# EAGLE design full (EAGLE 7.0.0)
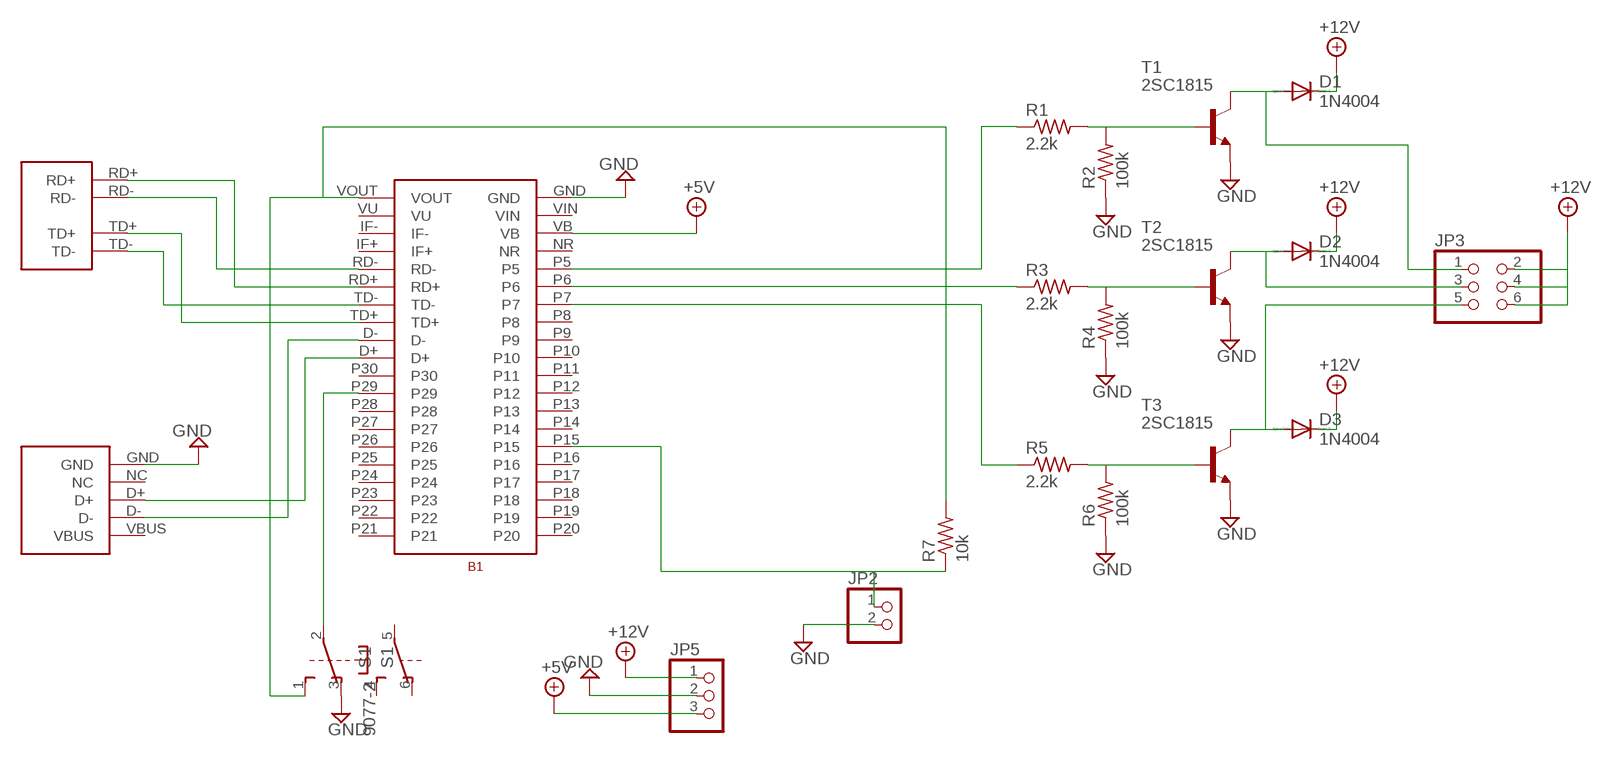
[diagram p0: schematic, sheet 1]

## Parts
B1  MBED_LPC1768  [MBED_LPC1768]
D1  1N4004  [DO41-10]
D2  1N4004  [DO41-10]
D3  1N4004  [DO41-10]
JP2  PINHD-1X2  [1X02]
JP3  PINHD-2X3  [2X03]
JP5  PINHD-1X3  [1X03]
R1  2.2k  R-US_0204/7  [0204/7]
R2  100k  R-US_0204/7  [0204/7]
R3  2.2k  R-US_0204/7  [0204/7]
R4  100k  R-US_0204/7  [0204/7]
R5  2.2k  R-US_0204/7  [0204/7]
R6  100k  R-US_0204/7  [0204/7]
R7  10k  R-US_0204/7  [0204/7]
RJ45_DIP1  AKIZUKI_RJ45_DIP  [AKIZUKI_RJ45_DIP]
S1  9077-2  [9077-2]
T1  2SC1815  [TO92-ECB]
T2  2SC1815  [TO92-ECB]
T3  2SC1815  [TO92-ECB]
USB_B1  AKIZUKI_MINI_USB_DIP  [AKIZUKI_MINI_USB_DIP]

## Nets
+5V: B1.VB JP5.3
+12V: D1.C D2.C D3.C JP3.2 JP3.4 JP3.6 JP5.1
GND: B1.GND JP2.2 JP5.2 R2.1 R4.1 R6.1 S1.3(1:O) T1.E T2.E T3.E USB_B1.GND
N$1: R1.2 R2.2 T1.B
N$2: R3.2 R4.2 T2.B
N$3: R5.2 R6.2 T3.B
N$4: B1.P6 R3.1
N$5: B1.P5 R1.1
N$6: B1.P7 R5.1
N$7: D1.A JP3.1 T1.C
N$8: D2.A JP3.3 T2.C
N$9: D3.A JP3.5 T3.C
N$10: B1.RD- RJ45_DIP1.RD-
N$11: B1.RD+ RJ45_DIP1.RD+
N$12: B1.TD+ RJ45_DIP1.TD+
N$13: B1.TD- RJ45_DIP1.TD-
N$14: B1.P29
N$15: B1.D+ USB_B1.D+
N$16: B1.D- USB_B1.D-
N$27: B1.P15 JP2.1 R7.1
N$29: B1.VOUT R7.2 S1.1(1:S)
Unconnected: B1.IF+ B1.IF- B1.NR B1.P8 B1.P9 B1.P10 B1.P11 B1.P12 B1.P13 B1.P14 B1.P16 B1.P17 B1.P18 B1.P19 B1.P20 B1.P21 B1.P22 B1.P23 B1.P24 B1.P25 B1.P26 B1.P27 B1.P28 B1.P30 S1.2(1:P) S1.4(2:S) S1.5(2:P) S1.6(2:O) USB_B1.NC

## Power pins joined to a net without a drawn wire
VBUS: USB_B1.VBUS
VIN: B1.VIN
VU: B1.VU

## Library data of the parts
B1 = mbed_LPC1768:MBED_LPC1768
D1-D3 = diode:1N4004: DIODE general purpose rectifier, 1 A
JP2 = pinhead:PINHD-1X2: PIN HEADER
JP3 = pinhead:PINHD-2X3: PIN HEADER
JP5 = pinhead:PINHD-1X3: PIN HEADER
R1-R7 = rcl:R-US_: RESISTOR, American symbol
RJ45_DIP1 = akizuki_rj45_dip:AKIZUKI_RJ45_DIP
S1 = switch-misc:9077-2: MARQUARDT SWITCH 9077.0200 Distributor: Buerklin <https://www.buerklin.com/default.asp?event=ShowArtikel%2812G2822%29&l=d&jump=ArtNr_12G2822>
T1-T3 = transistor:2SC1815: NPN EPITAXIAL TRANSISTOR Source: TOSHIBA .. 2SC1815 1.pdf
USB_B1 = akizuki_mini_usb_dip:AKIZUKI_MINI_USB_DIP

## Board
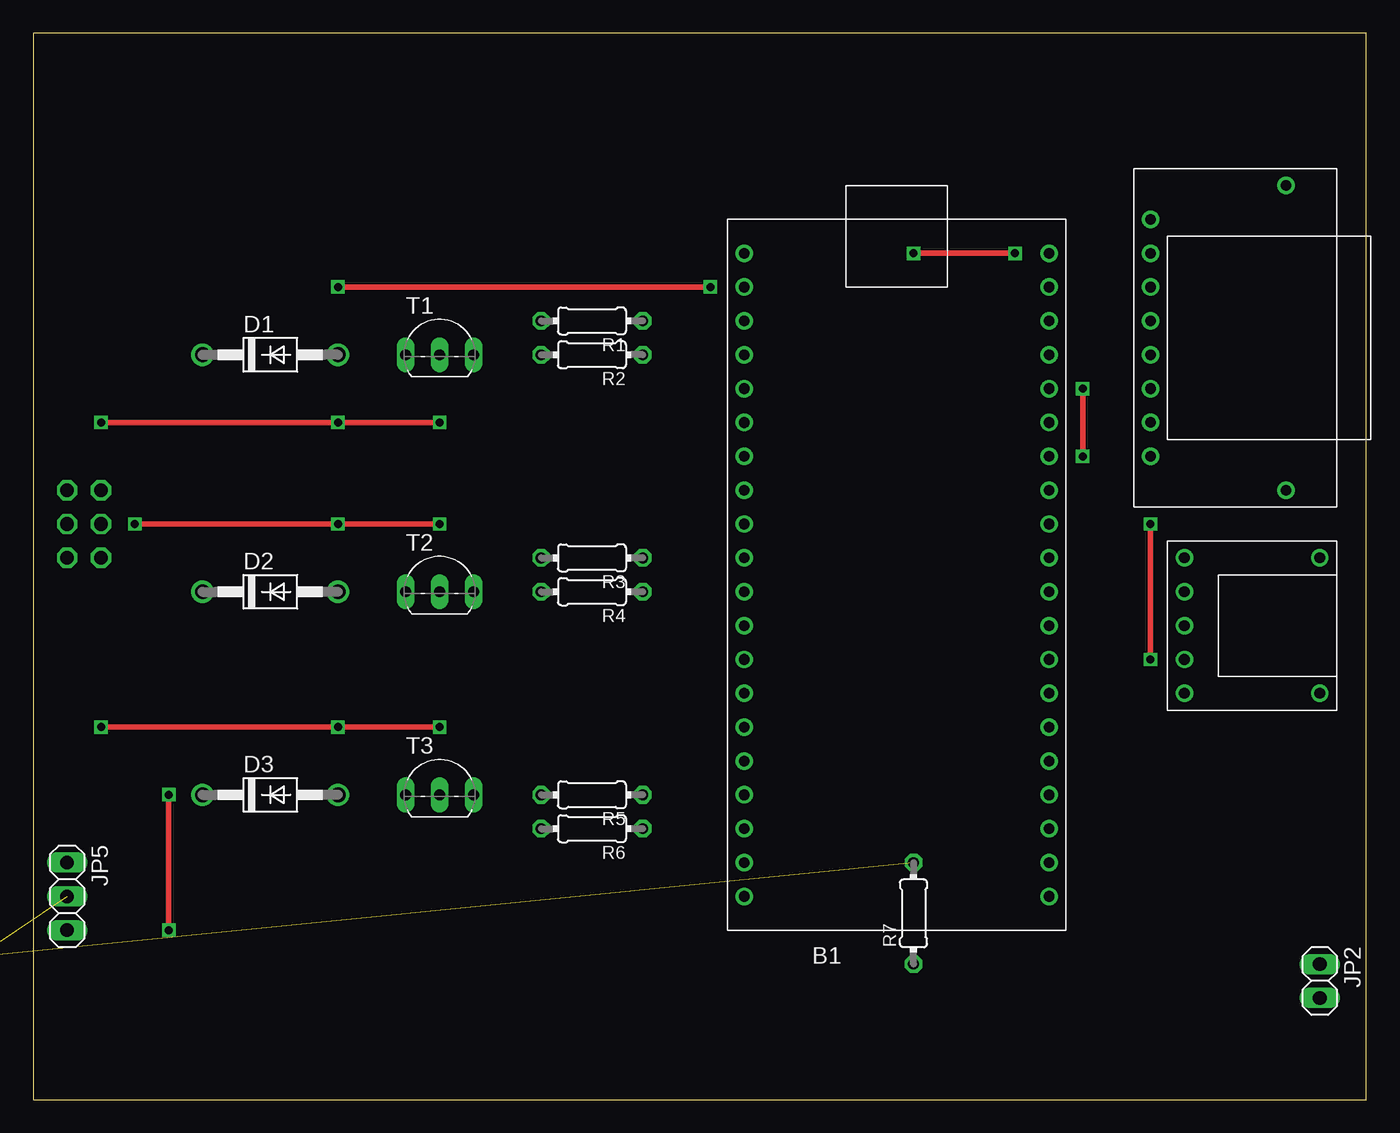
[diagram p1: board, top side]
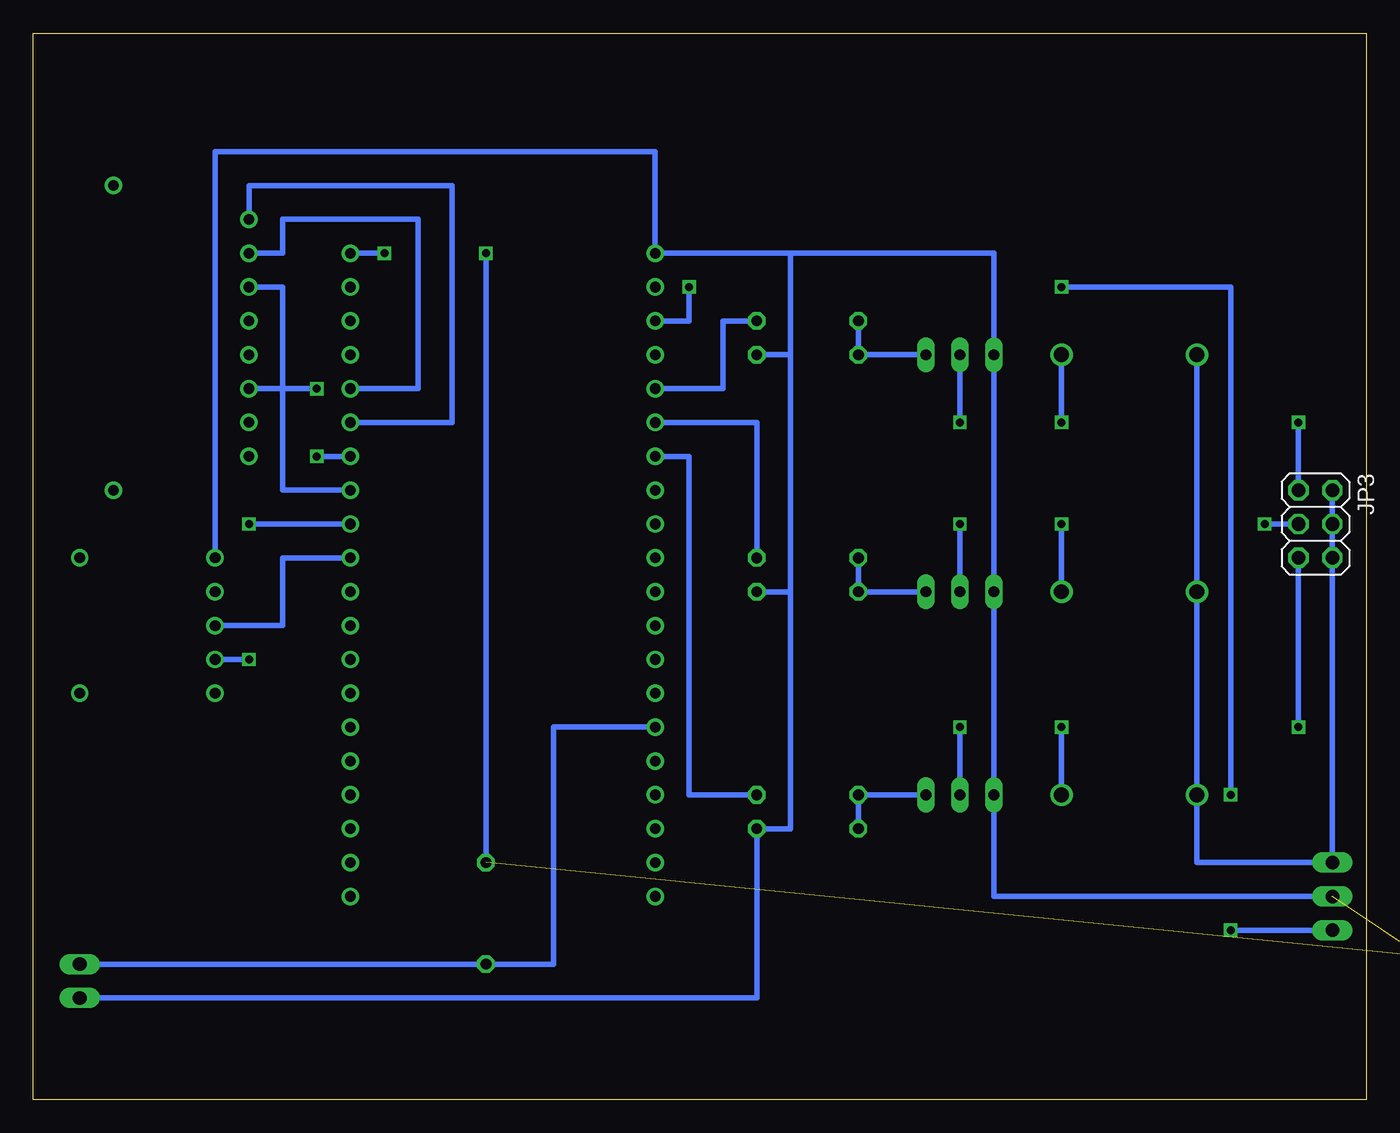
[diagram p2: board, bottom side, seen from below]

Size 100 x 80 mm. Coordinates in mm from the lower left corner, seen from the top.
Outline: 0,0 100,0 100,80 0,80 0,0
Copper layers (1*16): Top 0.035mm / dielectric 1.5mm / Bottom 0.035mm
Design rules "default": minimum track width 10mil, minimum drill 24mil, track to track 8mil, track to pad 8mil, pad to pad 8mil, via to via 8mil, smd to smd 8mil, copper to edge 40mil, drill to drill 8mil, minimum pad ring 10mil, minimum via ring 8mil, stop-mask expansion 4mil, vias tented up to drill 0mil, thermal gap 10mil

### Footprints (pad centres in the part's own frame; a part is rotated, then mirrored left to right if it is on the bottom)
MBED_LPC1768 = drill 0.8: D+ -17.78,-7.62; D- -17.78,-5.08; GND -40.64,15.24; IF+ -17.78,7.62; IF- -17.78,10.16; NR -40.64,7.62; P5 -40.64,5.08; P6 -40.64,2.54; P7 -40.64,0; P8 -40.64,-2.54; P9 -40.64,-5.08; P10 -40.64,-7.62; P11 -40.64,-10.16; P12 -40.64,-12.7; P13 -40.64,-15.24; P14 -40.64,-17.78; P15 -40.64,-20.32; P16 -40.64,-22.86; P17 -40.64,-25.4; P18 -40.64,-27.94; P19 -40.64,-30.48; P20 -40.64,-33.02; P21 -17.78,-33.02; P22 -17.78,-30.48; P23 -17.78,-27.94; P24 -17.78,-25.4; P25 -17.78,-22.86; P26 -17.78,-20.32; P27 -17.78,-17.78; P28 -17.78,-15.24; P29 -17.78,-12.7; P30 -17.78,-10.16; RD+ -17.78,2.54; RD- -17.78,5.08; TD+ -17.78,-2.54; TD- -17.78,0; VB -40.64,10.16; VIN -40.64,12.7; VOUT -17.78,15.24; VU -17.78,12.7
DO41-10 = drill 1.118: A 5.08,0; C -5.08,0
1X02 = drill 1.016 long: 1 -1.27,0; 2 1.27,0
2X03 = drill 1.016 octagon: 1 -2.54,-1.27; 2 -2.54,1.27; 3 0,-1.27; 4 0,1.27; 5 2.54,-1.27; 6 2.54,1.27
1X03 = drill 1.016 long: 1 -2.54,0; 2 0,0; 3 2.54,0
0204/7 = drill 0.813 octagon: 1 -3.81,0; 2 3.81,0
AKIZUKI_RJ45_DIP = drill 0.8: P$3 0,-5.08; P$4 2.54,-5.08; P$6 7.62,-5.08; P$7 10.16,-5.08; P$9 -10.16,5.08; P$10 12.7,5.08; RD+ -7.62,-5.08; RD- -5.08,-5.08; TD+ -2.54,-5.08; TD- 5.08,-5.08
9077-2 = drill 0.813 long: 1 -2.54,2.54; 2 0,2.54; 3 2.54,2.54; 4 -2.54,-2.54; 5 0,-2.54; 6 2.54,-2.54
TO92-ECB = drill 0.813 long: B 2.54,0; C 0,0; E -2.54,0
AKIZUKI_MINI_USB_DIP = drill 0.8: D+ 0,-5.08; D- 2.54,-5.08; GND -5.08,-5.08; NC -2.54,-5.08; P$6 -5.08,5.08; P$7 5.08,5.08; VBUS 5.08,-5.08

### Placement (x,y rotation side)
B1  93.98,48.26 0 top
D1  17.78,55.88 0 top
D2  17.78,38.1 0 top
D3  17.78,22.86 0 top
JP2  96.52,8.89 270 top
JP3  3.81,43.18 270 bottom
JP5  2.54,15.24 270 top
R1  41.91,58.42 180 top
R2  41.91,55.88 180 top
R3  41.91,40.64 180 top
R4  41.91,38.1 180 top
R5  41.91,22.86 180 top
R6  41.91,20.32 180 top
R7  66.04,13.97 90 top
RJ45_DIP1  88.9,58.42 270 top
S1  -7.62,7.62 0 top  (outside the outline)
T1  30.48,55.88 0 top
T2  30.48,38.1 0 top
T3  30.48,22.86 0 top
USB_B1  91.44,35.56 270 top

### Tracks (layer width: path | path; a pad name or v marks a point on that pad's centre or on a via)
+5V  (via drill 0.6)
  Top 0.406: v10.16,12.7 v10.16,22.86 | v22.86,60.96 v50.8,60.96
  Bottom 0.406: JP5.3 v10.16,12.7 | v10.16,22.86 10.16,60.96 v22.86,60.96 | v50.8,60.96 50.8,58.42 B1.VB
+12V
  Bottom 0.406: JP3.2 JP3.4 JP3.6 JP5.1 12.7,17.78 D3.C D2.C D1.C
GND  (1 unrouted)
  Bottom 0.406: USB_B1.GND 86.36,71.12 53.34,71.12 B1.GND 43.18,63.5 | 43.18,63.5 27.94,63.5 T1.E T2.E T3.E 27.94,15.24 JP5.2 | 43.18,63.5 43.18,55.88 | R2.1 43.18,55.88 | 43.18,55.88 43.18,38.1 | R4.1 43.18,38.1 | 43.18,38.1 43.18,20.32 R6.1 45.72,7.62 JP2.2
N$1
  Bottom 0.406: R1.2 R2.2 T1.B
N$2
  Bottom 0.406: R3.2 R4.2 T2.B
N$3
  Bottom 0.406: R6.2 R5.2 T3.B
N$4
  Bottom 0.406: B1.P6 45.72,50.8 R3.1
N$5
  Bottom 0.406: B1.P5 48.26,53.34 48.26,58.42 R1.1
N$6
  Bottom 0.406: B1.P7 50.8,48.26 50.8,22.86 R5.1
N$7  (via drill 0.6)
  Top 0.406: v5.08,50.8 v22.86,50.8 v30.48,50.8
  Bottom 0.406: JP3.1 v5.08,50.8 | v22.86,50.8 D1.A | T1.C v30.48,50.8
N$8  (via drill 0.6)
  Top 0.406: v30.48,43.18 v22.86,43.18 v7.62,43.18
  Bottom 0.406: T2.C v30.48,43.18 | v22.86,43.18 D2.A | JP3.3 v7.62,43.18
N$9  (via drill 0.6)
  Top 0.406: v30.48,27.94 v22.86,27.94 v5.08,27.94
  Bottom 0.406: T3.C v30.48,27.94 | v22.86,27.94 D3.A | JP3.5 v5.08,27.94
N$10
  Bottom 0.406: B1.RD- 71.12,53.34 71.12,66.04 81.28,66.04 81.28,63.5 RJ45_DIP1.RD-
N$11
  Bottom 0.406: B1.RD+ 68.58,50.8 68.58,68.58 83.82,68.58 RJ45_DIP1.RD+
N$12
  Bottom 0.406: B1.TD+ 81.28,45.72 81.28,60.96 RJ45_DIP1.TD+
N$13  (via drill 0.6)
  Top 0.406: v78.74,48.26 v78.74,53.34
  Bottom 0.406: B1.TD- v78.74,48.26 | RJ45_DIP1.TD- v78.74,53.34
N$15
  Bottom 0.406: B1.D+ 81.28,40.64 81.28,35.56 USB_B1.D+
N$16  (via drill 0.6)
  Top 0.406: v83.82,43.18 v83.82,33.02
  Bottom 0.406: B1.D- v83.82,43.18 | v83.82,33.02 USB_B1.D-
N$27
  Bottom 0.406: B1.P15 60.96,27.94 60.96,10.16 R7.1 JP2.1
N$29  (via drill 0.6)  (1 unrouted)
  Top 0.406: v73.66,63.5 v66.04,63.5
  Bottom 0.406: B1.VOUT v73.66,63.5 | v66.04,63.5 R7.2